# EAGLE schematic valhalla-structured (EAGLE 9.0.0)
Structured Cabling Operation "Valhalla" CLASSIFIED: SECRET, NEED-TO-KNOW-ONLY This is the schematic of the structured cabling network, it tries to mimic the physical placement of all components in an attempt to provide the data for conduit loading.

## Sheet 1 of 2: Ground Floor
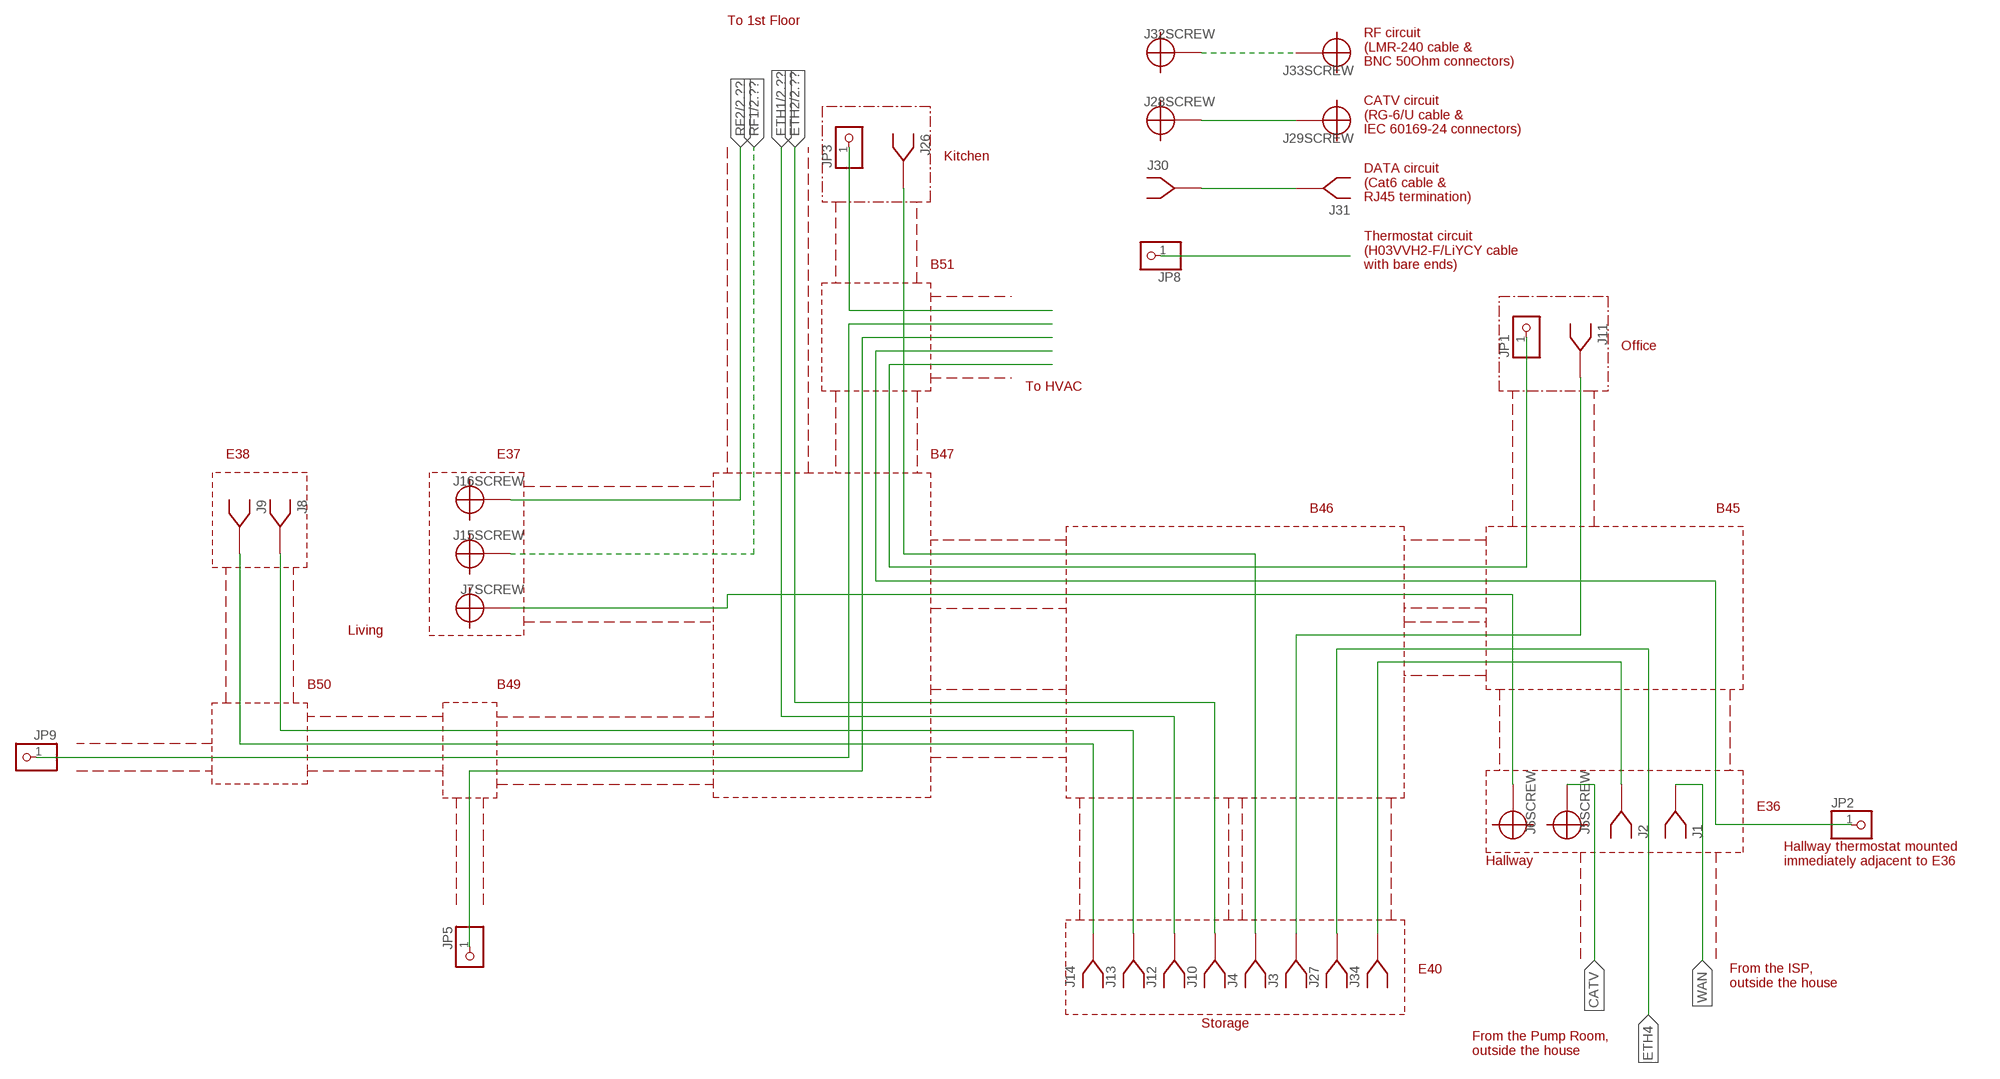
[diagram p0: schematic, sheet 1]

### Parts
JP1  PINHD-1X1  [1X01]
JP2  PINHD-1X1  [1X01]
JP3  PINHD-1X1  [1X01]
JP5  PINHD-1X1  [1X01]
JP8  PINHD-1X1  [1X01]
JP9  PINHD-1X1  [1X01]

### Nets
N$1: JP1.1
N$2: JP3.1
N$3: JP2.1
N$5: JP5.1
N$8: JP8.1
N$9: JP9.1

### Notes on the sheet
- To 1st Floor
- RF circuit
  (LMR-240 cable &
  BNC 50Ohm connectors)
- CATV circuit
  (RG-6/U cable &
  IEC 60169-24 connectors)
- Kitchen
- DATA circuit
  (Cat6 cable &
  RJ45 termination)
- B51
- Thermostat circuit
  (H03VVH2-F/LiYCY cable
  with bare ends)
- Office
- To HVAC
- E38 | E37 | B47
- B46 | B45
- Living
- B50 | B49
- E36
- Hallway
- Hallway thermostat mounted
  immediately adjacent to E36
- E40
- From the ISP,
  outside the house
- Storage
- From the Pump Room,
  outside the house

## Sheet 2 of 2: First Floor
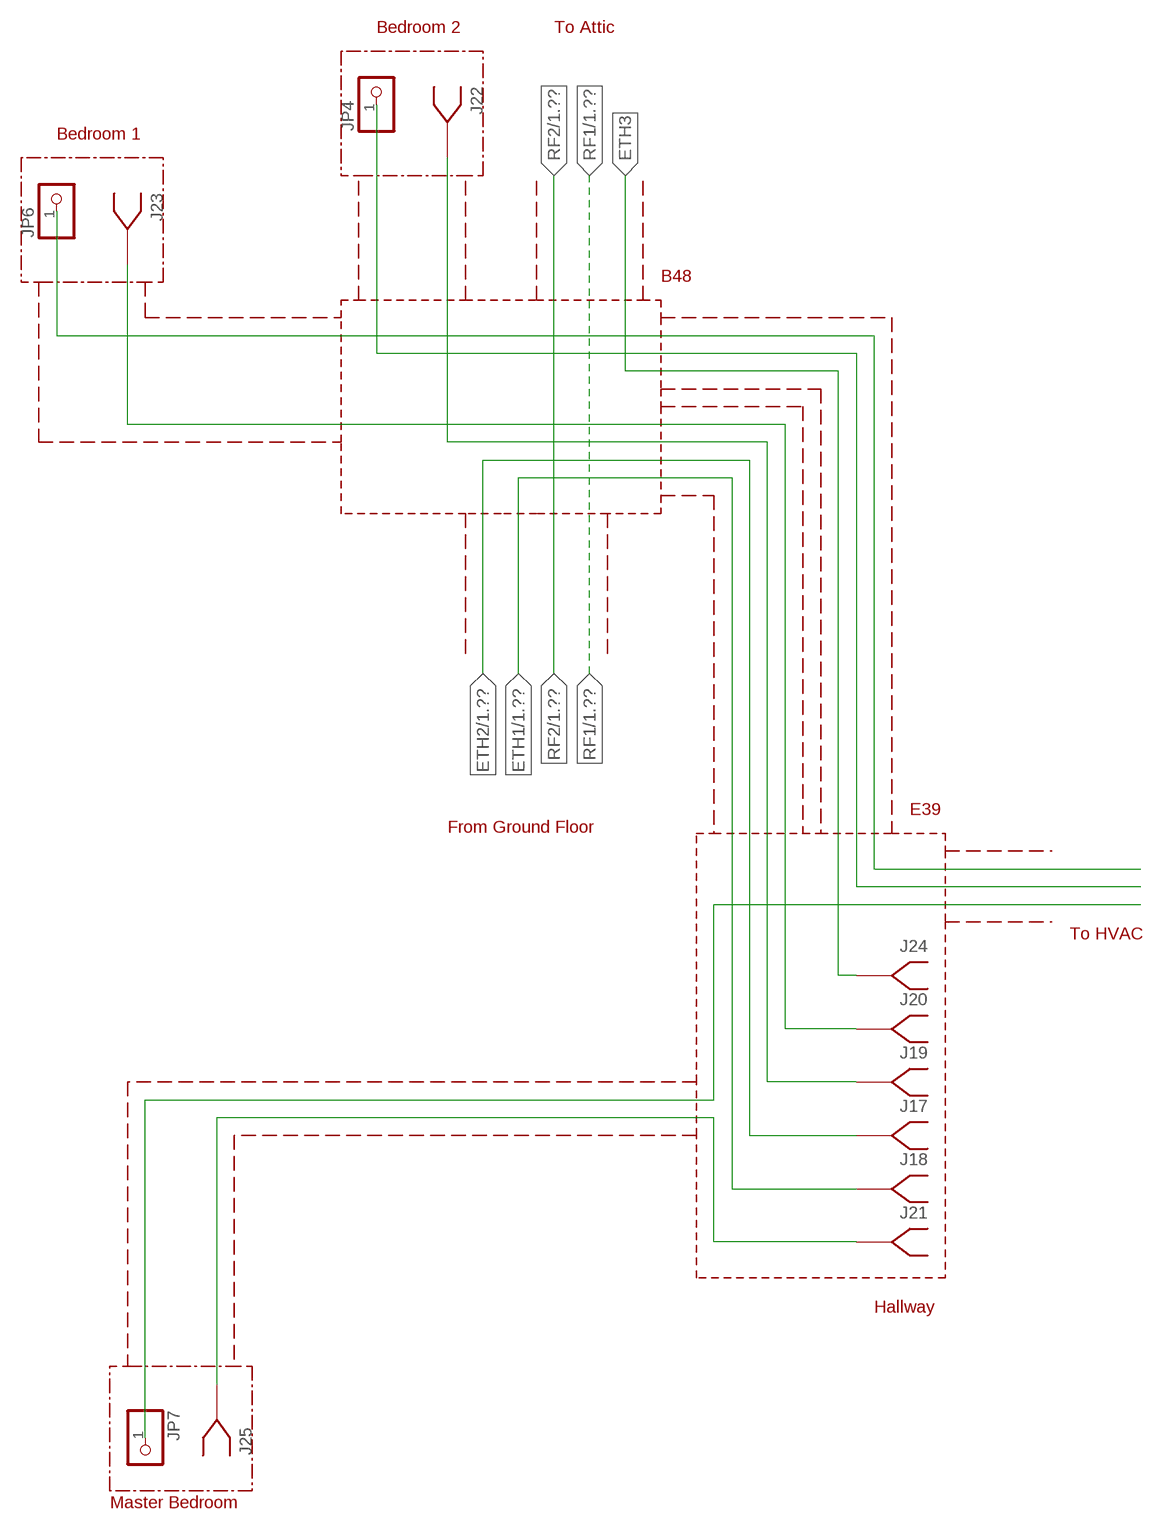
[diagram p1: schematic, sheet 2]

### Parts
JP4  PINHD-1X1  [1X01]
JP6  PINHD-1X1  [1X01]
JP7  PINHD-1X1  [1X01]

### Nets
N$4: JP4.1
N$6: JP6.1
N$7: JP7.1

### Notes on the sheet
- Bedroom 2 | To Attic
- Bedroom 1
- B48
- E39
- From Ground Floor
- To HVAC
- Hallway
- Master Bedroom

## Library data of the parts
JP1-JP9 = pinhead:PINHD-1X1: PIN HEADER